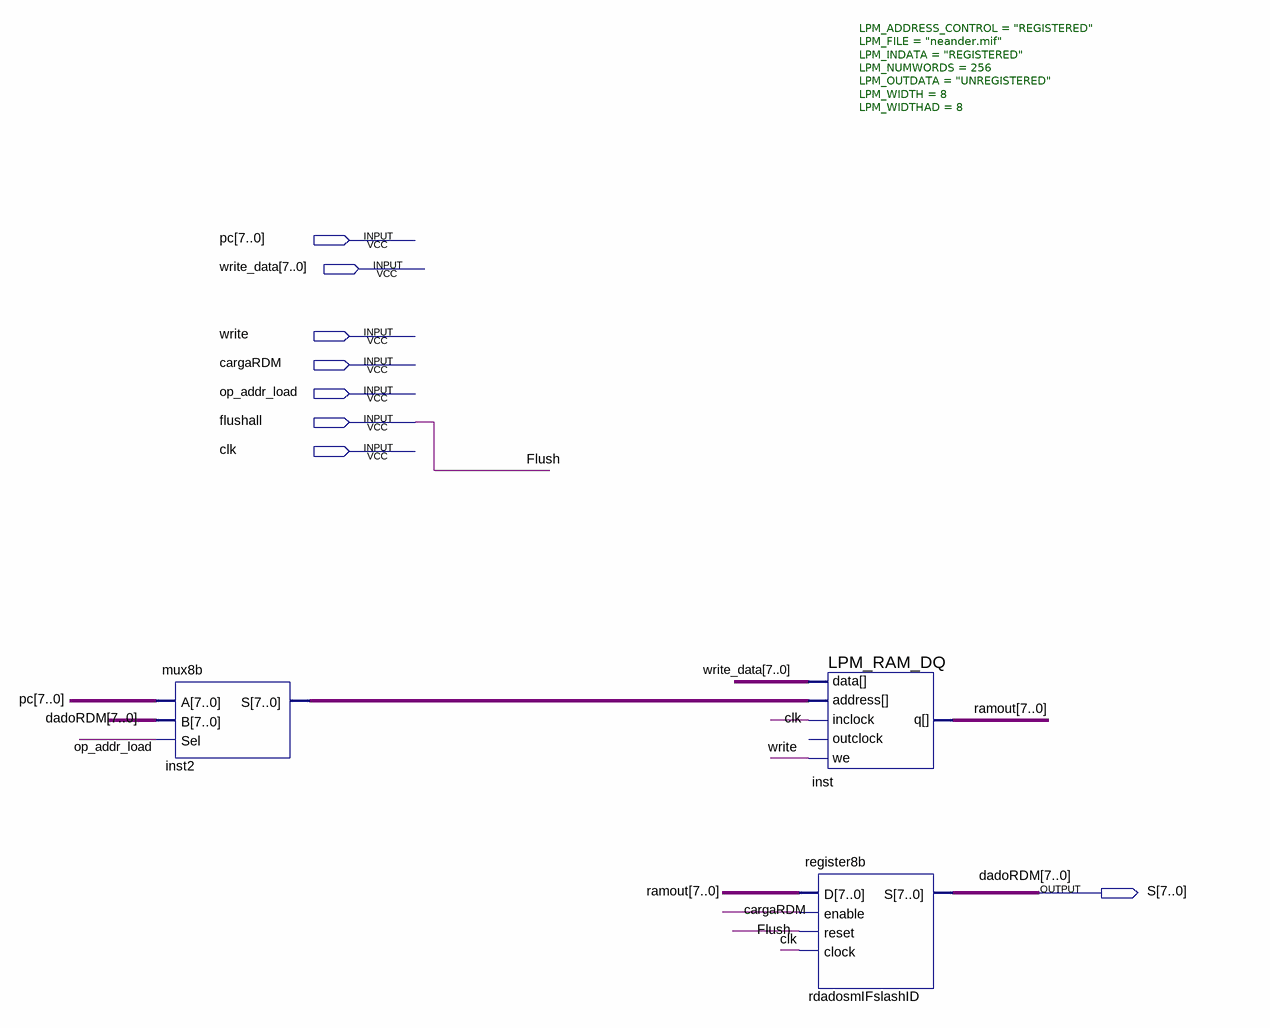
[diagram p0: schematic sheet]
// Quartus schematic faster_mem_unit.bdf as structural Verilog: 3 symbols, 8 pins
module faster_mem_unit (
  input  [7:0] pc,
  input  [7:0] write_data,
  input  write,
  input  cargaRDM,
  input  op_addr_load,
  input  flushall,
  input  clk,
  output [7:0] S
);

  wire [7:0] inst2_s, ramout;

  mux8b inst2 (.A(pc), .B(S), .Sel(op_addr_load), .S(inst2_s));
  LPM_RAM_DQ #(.LPM_ADDRESS_CONTROL("REGISTERED"), .LPM_FILE("neander.mif"), .LPM_INDATA("REGISTERED"), .LPM_NUMWORDS(256), .LPM_OUTDATA("UNREGISTERED"), .LPM_WIDTH(8), .LPM_WIDTHAD(8)) inst (
    .inclock(clk), .data(write_data), .address(inst2_s), .we(write), .q(ramout));  // open: outclock
  register8b rdadosmIFslashID (.D(ramout), .enable(cargaRDM), .reset(flushall), .clock(clk), .S(S));

  // Other names for the same wires on the sheet: dadoRDM[7:0] = S; Flush = flushall
endmodule
